# Altium project STM32407VG_DevBoard.PrjPcb
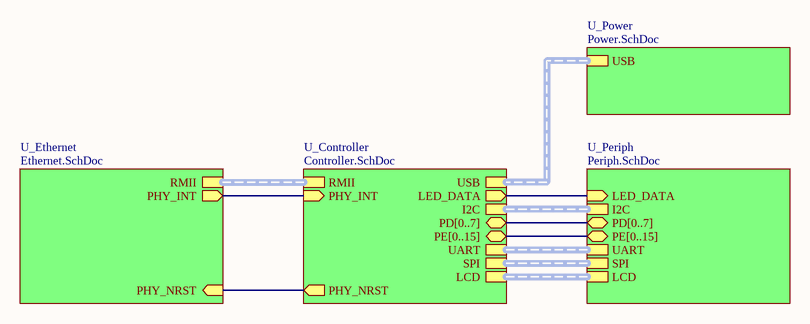
[diagram p0: Main.SchDoc]
5 sheets, 94 parts. Net scope: hierarchical (ports join the sheet entries above them; power ports are global).
Board file: PCB_STM32F407VG.PcbDoc
Sheets:
  Main.SchDoc
    U_Ethernet = Ethernet.SchDoc
    U_Periph = Periph.SchDoc
    U_Controller = Controller.SchDoc
    U_Power = Power.SchDoc

## Sheet Main.SchDoc
size A4; SheetNumber: 1; SheetTotal: 5

### Sub-sheets
U_Controller = Controller.SchDoc: RMII (harness RMII), PHY_INT (in), PHY_NRST (out), USB (harness USB), LED_DATA (out), I2C (harness I2c), PD[0..7] (bidir), PE[0..15] (bidir), UART (harness UART), SPI (harness SPI), LCD (harness LCD)
U_Ethernet = Ethernet.SchDoc: RMII (harness RMII), PHY_INT (out), PHY_NRST (in)
U_Periph = Periph.SchDoc: I2C (harness I2c), LED_DATA (in), PD[0..7] (bidir), PE[0..15] (bidir), UART (harness UART), SPI (harness SPI), LCD (harness LCD)
U_Power = Power.SchDoc: USB (harness USB)

### Nets
LED_DATA: sheet U_Periph/LED_DATA, sheet U_Controller/LED_DATA
PHY_INT: sheet U_Ethernet/PHY_INT, sheet U_Controller/PHY_INT
PHY_NRST: sheet U_Ethernet/PHY_NRST, sheet U_Controller/PHY_NRST

### Buses and harness runs
bus sheet U_Controller/PD[0..7] = sheet U_Periph/PD[0..7]
bus sheet U_Controller/PE[0..15] = sheet U_Periph/PE[0..15]
harness sheet U_Controller/I2C = sheet U_Periph/I2C
harness sheet U_Controller/LCD = sheet U_Periph/LCD
harness sheet U_Controller/RMII = sheet U_Ethernet/RMII
harness sheet U_Controller/SPI = sheet U_Periph/SPI
harness sheet U_Controller/UART = sheet U_Periph/UART
harness sheet U_Controller/USB = sheet U_Power/USB

## Sheet Ethernet.SchDoc
size A4; SheetNumber: 3; SheetTotal: 5
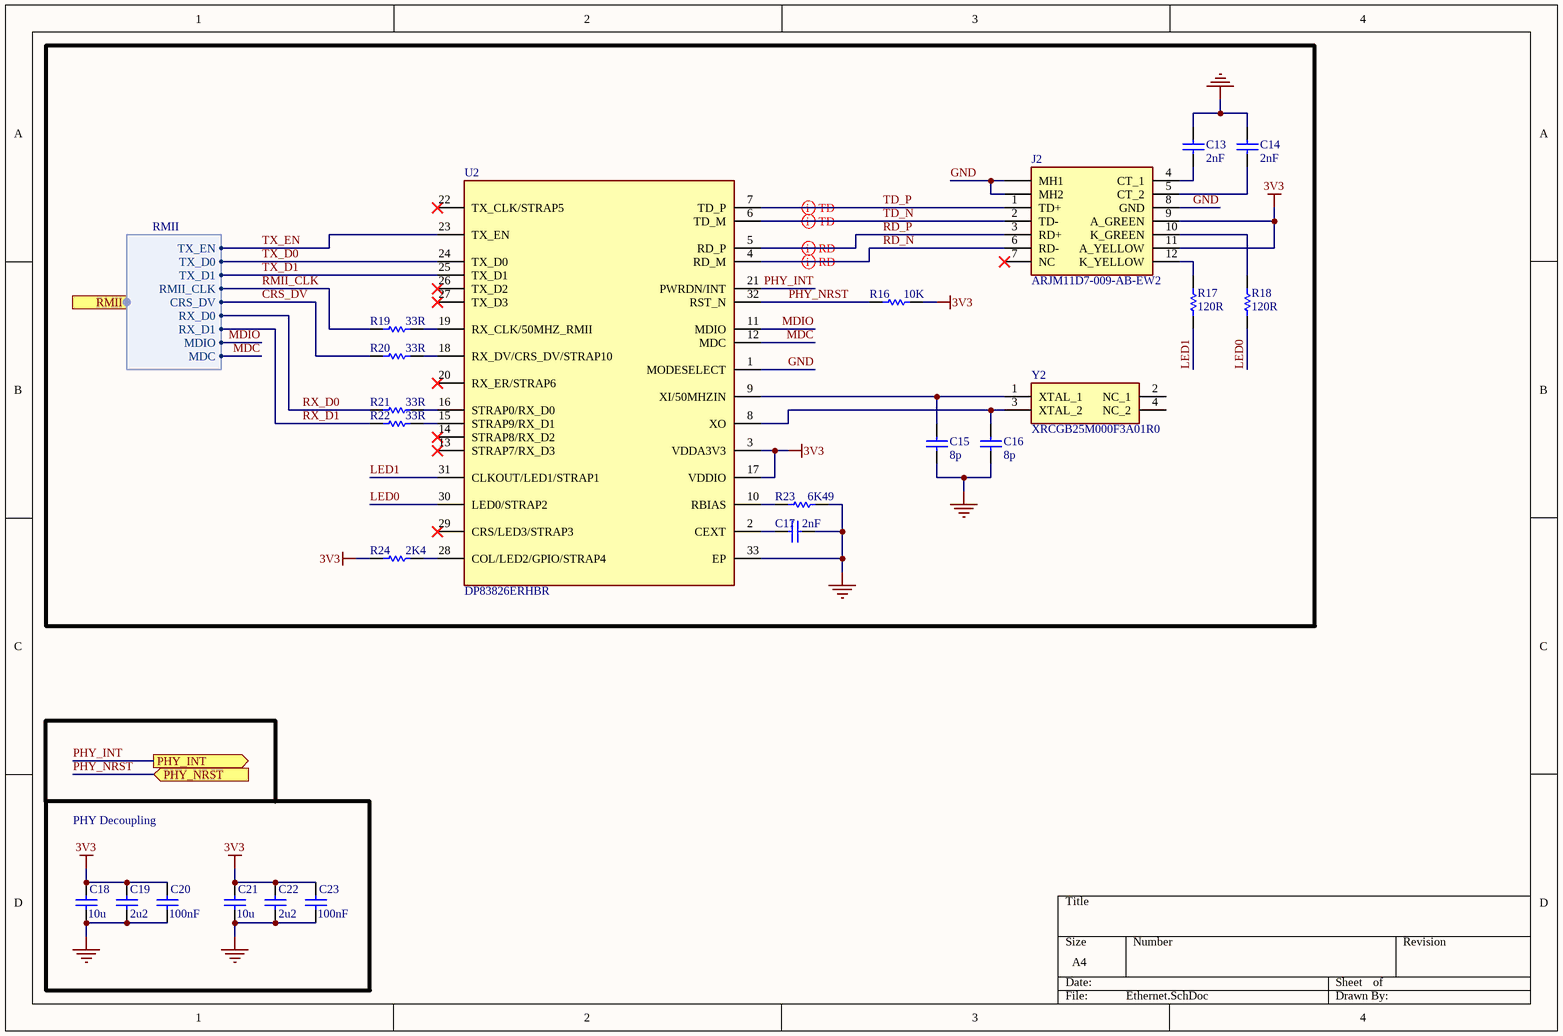
[diagram p1: Ethernet.SchDoc]

### Parts
C13  2nF  [0603]
C14  2nF  [0603]
C15  8p  [0603]
C16  8p  [0603]
C17  2nF  [0603]
C18  10u  [1206]
C19  2u2  [1206]
C20  100nF  [0603]
C21  10u  [1206]
C22  2u2  [1206]
C23  100nF  [0603]
J2  ARJM11D7-009-AB-EW2  [ARJM11D7009ABEW2]
R16  10K  [0603]
R17  120R  [0603]
R18  120R  [0603]
R19  33R  [0603]
R20  33R  [0603]
R21  33R  [0603]
R22  33R  [0603]
R23  6K49  [0603]
R24  2K4  [0603]
U2  DP83826ERHBR  [QFN50P500X500X100-33N-D]
Y2  XRCGB25M000F3A01R0  [XRCGB]

### Blocks framed on the sheet
PHY Decoupling: C18-C23

### Ports
PHY_INT (out, see Main[1A], Controller[1D]), PHY_NRST (in, see Main[1B], Controller[1D]), RMII (harness RMII, see Main[1A], Controller[3D])

### Harnesses
RMII: TX_EN, TX_D0, TX_D1, RMII_CLK, CRS_DV, RX_D0, RX_D1, MDIO, MDC

### Nets
3V3: C18.2 C19.2 C20.2 C21.2 C22.2 C23.2 J2.9(A_GREEN) J2.11(A_YELLOW) R16.2 R24.1 U2.3(VDDA3V3) U2.17(VDDIO)
GND: C13.2 C14.2 C15.1 C16.1 C17.2 C18.1 C19.1 C20.1 C21.1 C22.1 C23.1 J2.8(GND) J2.MH1 J2.MH2 R23.2 U2.1(MODESELECT) U2.33(EP)
CRS_DV: R20.1 ; port RMII.CRS_DV
LED0: R18.1 U2.30(LED0/STRAP2)
LED1: R17.1 U2.31(CLKOUT/LED1/STRAP1)
MDC: U2.12(MDC) ; port RMII.MDC
MDIO: U2.11(MDIO) ; port RMII.MDIO
PHY_INT: U2.21(PWRDN/INT) ; port PHY_INT
PHY_NRST: R16.1 U2.32(RST_N) ; port PHY_NRST
RD_N: J2.6(RD-) U2.4(RD_M)
RD_P: J2.3(RD+) U2.5(RD_P)
RMII_CLK: R19.1 ; port RMII.RMII_CLK
RX_D0: R21.1 ; port RMII.RX_D0
RX_D1: R22.1 ; port RMII.RX_D1
TD_N: J2.2(TD-) U2.6(TD_M)
TD_P: J2.1(TD+) U2.7(TD_P)
TX_D0: U2.24(TX_D0) ; port RMII.TX_D0
TX_D1: U2.25(TX_D1) ; port RMII.TX_D1
TX_EN: U2.23(TX_EN) ; port RMII.TX_EN
NetC13_1: C13.1 J2.4(CT_1)
NetC14_1: C14.1 J2.5(CT_2)
NetC15_2: C15.2 U2.9(XI/50MHZIN) Y2.1(XTAL_1)
NetC16_2: C16.2 U2.8(XO) Y2.3(XTAL_2)
NetC17_1: C17.1 U2.2(CEXT)
NetJ2_10: J2.10(K_GREEN) R18.2
NetJ2_12: J2.12(K_YELLOW) R17.2
NetR19_2: R19.2 U2.19(RX_CLK/50MHZ_RMII)
NetR20_2: R20.2 U2.18(RX_DV/CRS_DV/STRAP10)
NetR21_2: R21.2 U2.16(STRAP0/RX_D0)
NetR22_2: R22.2 U2.15(STRAP9/RX_D1)
NetR23_1: R23.1 U2.10(RBIAS)
NetR24_2: R24.2 U2.28(COL/LED2/GPIO/STRAP4)

Not connected (* = marked no-connect by the designer): J2 7(NC)*; U2 13(STRAP7/RX_D3)* 14(STRAP8/RX_D2)* 20(RX_ER/STRAP6)* 22(TX_CLK/STRAP5)* 26(TX_D2)* 27(TX_D3)* 29(CRS/LED3/STRAP3)*; Y2 2(NC_1) 4(NC_2)

### Layout directives
differential pair: RD_N, RD_P, TD_N, TD_P

### Library data of the parts
C13 C14 C17 = C0603C202J5GACTU: Capacitor 50V / 0603; Value: 2nF
C15 C16 = 06033A8R0DAT2A: Capacitor 25V / 0603; Value: 8p
C18 C21 = C1206C106K3PACTU: Capacitor 50V / 1206; Value: 10u
C19 C22 = C1206C225K5RACAUTO7210: Capacitor 50V / 1206; Value: 2.2u
C20 C23 = C0603C104K1RACAUTO: Capacitor 100V / 0603; Value: 100n
J2 = ARJM11D7-009-AB-EW2: Connector; Manufacturer_Name: ABRACON; Datasheet Link: https://abracon.com/Magnetics/ARJM11.pdf; Height: 14.05mm; Manufacturer_Part_Number: ARJM11D7-009-AB-EW2; Mouser Part Number: 815-RJM11D7009ABEW2; Mouser Price/Stock: https://www.mouser.co.uk/ProductDetail/ABRACON/ARJM11D7-009-AB-EW2?qs=YCa%2FAAYMW01wgGAVSiGYdQ%3D%3D; Arrow Part Number: ARJM11D7-009-AB-EW2; Arrow Price/Stock: https://www.arrow.com/en/products/arjm11d7-009-ab-ew2/abracon?utm_currency=USD&region=europe
R16 = CRCW060310K0FKEA: Resistor 0.1W; Value: 10K
R17 R18 = CRCW0603120RFKEA: Resistor 0.1W; Value: 120R
R19-R22 = CRCW060333R0FKEA: Resistor 0.1W; Value: 33R
R23 = CRCW06036K49FKEA: Resistor 0.1W; Value: 6K49
R24 = CRCW06032K40FKEA: Resistor 0.1W; Value: 2K4
U2 = DP83826ERHBR: Integrated Circuit; Manufacturer_Name: Texas Instruments; Datasheet Link: https://www.ti.com/lit/ds/symlink/dp83826i.pdf?ts=1636699378977&ref_url=https%253A%252F%252Fwww.ti.com%252Fproduct%252FDP83826I; Height: 1mm; Manufacturer_Part_Number: DP83826ERHBR; Mouser Part Number: 595-DP83826ERHBR; Mouser Price/Stock: https://www.mouser.co.uk/ProductDetail/Texas-Instruments/DP83826ERHBR?qs=xZ%2FP%252Ba9zWqY4e7L7xapfgA%3D%3D; Arrow Part Number: DP83826ERHBR; Arrow Price/Stock: https://www.arrow.com/en/products/dp83826erhbr/texas-instruments?region=nac
Y2 = XRCGB25M000F3A01R0: Crystal or Oscillator; Manufacturer_Name: Murata Electronics; Datasheet Link: https://www.murata.com/products/productdata/8803384393758/SPEC-XRCGB25M000F3A01R0.pdf; Height: 0.7mm; Manufacturer_Part_Number: XRCGB25M000F3A01R0; Mouser Part Number: 81-XRCGB25M000F3A01R; Mouser Price/Stock: https://www.mouser.co.uk/ProductDetail/Murata-Electronics/XRCGB25M000F3A01R0?qs=xZ%2FP%252Ba9zWqYh5DvumW%252BlTA%3D%3D; Arrow Part Number: XRCGB25M000F3A01R0; Arrow Price/Stock: https://www.arrow.com/en/products/xrcgb25m000f3a01r0/murata-manufacturing?region=nac

## Sheet Periph.SchDoc
size A4; SheetNumber: 5; SheetTotal: 5
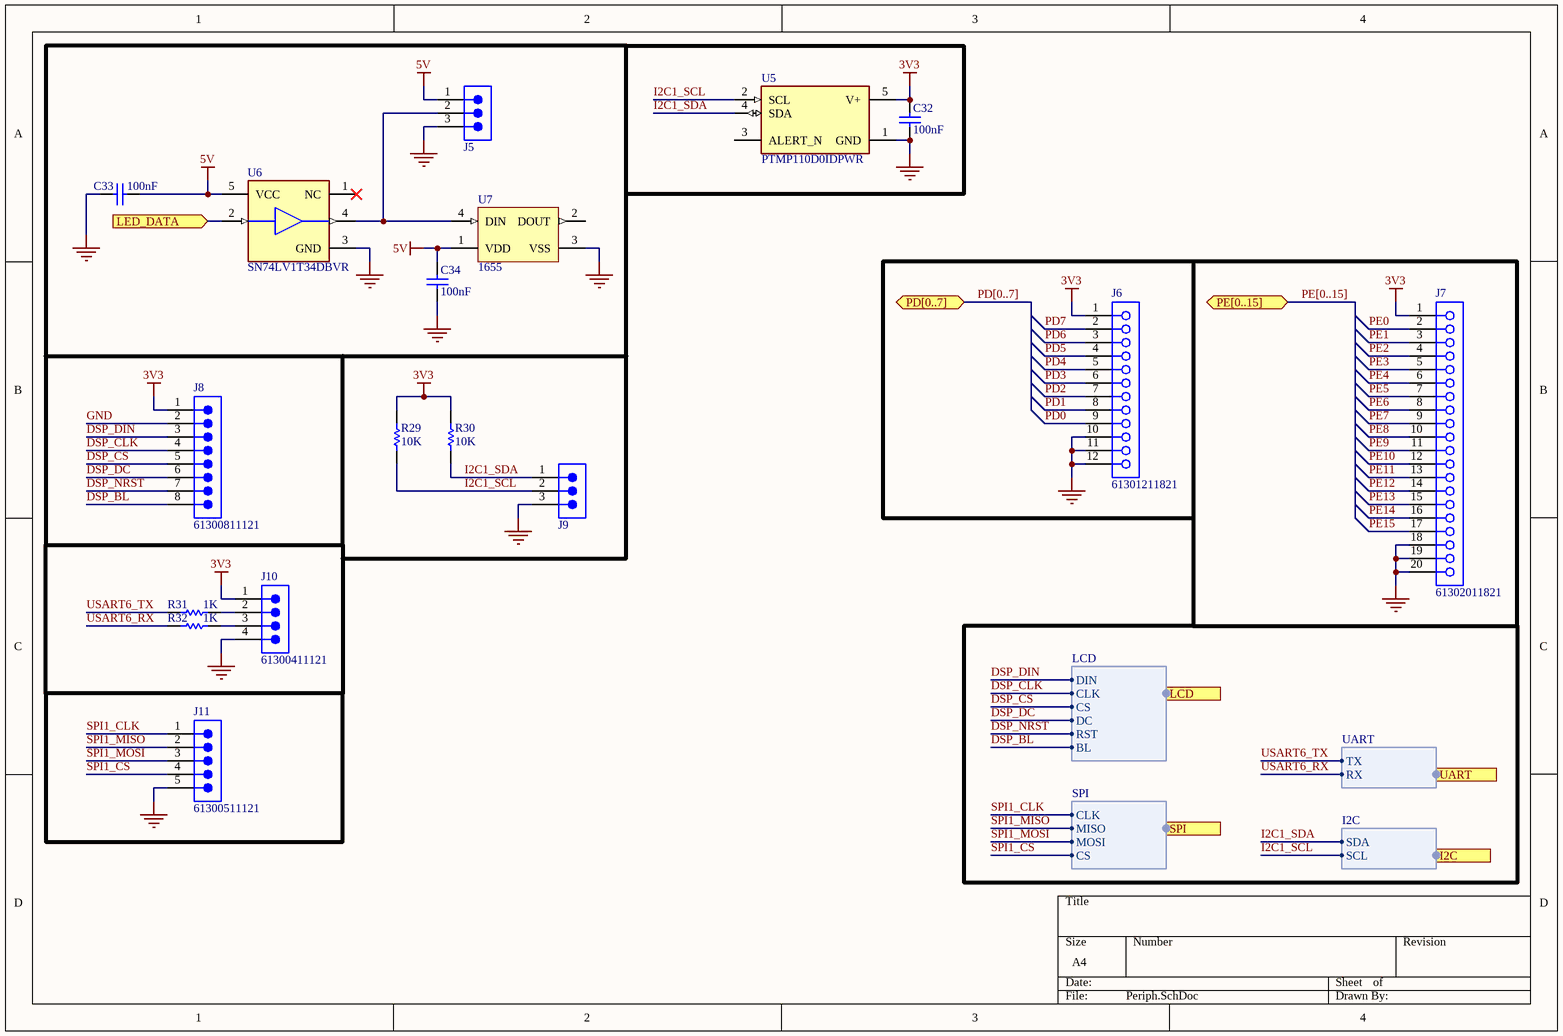
[diagram p2: Periph.SchDoc]

### Parts
C32  100nF  [0603]
C33  100nF  [0603]
C34  100nF  [0603]
J5  61300311121  [61300311121]  (value not drawn)
J6  61301211821  [61301211821]
J7  61302011821  [61302011821]
J8  61300811121  [61300811121]
J9  61300311121  [61300311121]  (value not drawn)
J10  61300411121  [61300411121]
J11  61300511121  [61300511121]
R29  10K  [0603]
R30  10K  [0603]
R31  1K  [0603]
R32  1K  [0603]
U5  PTMP110D0IDPWR  [DPW0005A-MFG]
U6  SN74LV1T34DBVR  [FP-DBV0005A-IPC_B]
U7  1655  [ADA-RGB-1655_V]

### Ports
I2C (harness I2c, see Main[2B], Controller[4C]), LCD (harness LCD, see Main[2B], Controller[3C]), LED_DATA (in, see Main[2A], Controller[1D]), PD[0..7] (bidir, see Main[2B], Controller[2B]), PE[0..15] (bidir, see Main[2B], Controller[1D]), SPI (harness SPI, see Main[2B], Controller[4C]), UART (harness UART, see Main[2B], Controller[4C])

### Harnesses
I2C: SDA, SCL
UART: TX, RX
SPI: CLK, MISO, MOSI, CS
LCD: DIN, CLK, CS, DC, RST, BL

### Nets
3V3: C32.1 J6.1 J7.1 J8.1 J10.1 R29.2 R30.2 U5.5(V+)
5V: C33.2 C34.1 J5.1 U6.5(VCC) U7.1(VDD)
GND: C32.2 C33.1 C34.2 J5.3 J6.10 J6.11 J6.12 J7.18 J7.19 J7.20 J8.2 J9.3 J10.4 J11.5 U5.1(GND) U6.3(GND) U7.3(VSS)
DSP_BL: J8.8 ; port LCD.BL
DSP_CLK: J8.4 ; port LCD.CLK
DSP_CS: J8.5 ; port LCD.CS
DSP_DC: J8.6 ; port LCD.DC
DSP_DIN: J8.3 ; port LCD.DIN
DSP_NRST: J8.7 ; port LCD.RST
I2C1_SCL: J9.2 R29.1 U5.2(SCL) ; port I2C.SCL
I2C1_SDA: J9.1 R30.1 U5.4(SDA) ; port I2C.SDA
LED_DATA: U6.2(A) ; port LED_DATA
PD0: J6.9
PD1: J6.8
PD2: J6.7
PD3: J6.6
PD4: J6.5
PD5: J6.4
PD6: J6.3
PD7: J6.2
PE0: J7.2
PE1: J7.3
PE2: J7.4
PE3: J7.5
PE4: J7.6
PE5: J7.7
PE6: J7.8
PE7: J7.9
PE8: J7.10
PE9: J7.11
PE10: J7.12
PE11: J7.13
PE12: J7.14
PE13: J7.15
PE14: J7.16
PE15: J7.17
SPI1_CLK: J11.1 ; port SPI.CLK
SPI1_CS: J11.4 ; port SPI.CS
SPI1_MISO: J11.2 ; port SPI.MISO
SPI1_MOSI: J11.3 ; port SPI.MOSI
USART6_RX: R32.1 ; port UART.RX
USART6_TX: R31.1 ; port UART.TX
NetJ5_2: J5.2 U6.4(Y) U7.4(DIN)
NetJ10_2: J10.2 R31.2
NetJ10_3: J10.3 R32.2

Not connected (* = marked no-connect by the designer): U5 3(ALERT_N); U6 1(NC)*; U7 2(DOUT)

### Buses and harness runs
bus PD[0..7] = port PD[0..7]
bus PE[0..15] = port PE[0..15]

### Library data of the parts
C32-C34 = C0603C104K1RACAUTO: Capacitor 100V / 0603; Value: 100n
J5 J9 = CMP-1502-01062-3: NexarPartId: 32855521; Current Rating: 3A; Voltage Rating: 250V; Number of Positions: 3; Pitch: 2.54mm; Contact Resistance: 20mΩ; Connector Type: Male Pin; Gender: Male; REACH SVHC: Unknown; Packaging: Bulk; Contact Material: Copper; Min Operating Temperature: -40°C; Number of Rows: 1; Orientation: Vertical; RoHS: Compliant; Contact Plating: Gold; Max Operating Temperature: 105°C; Mount: Through Hole; Height: 8.94mm; Operating Supply Voltage: 250V; Number of Pins: 3; Contact Mating Length: 5.9944mm; Number of Contacts: 3; Color: Black; Lead Free: Lead Free; Lead Pitch: 2.54mm; Termination: Solder
J6 = CMP-1502-01337-3: NexarPartId: 24514107; Operating Supply Voltage: 250V; Gender: Female; Current Rating: 3A; Contact Resistance: 20mΩ; Orientation: Vertical; Number of Pins: 12; RoHS: Non-Compliant; Lead Pitch: 2.54mm
J7 = CMP-1502-01348-3: NexarPartId: 61924744; Gender: Female; Current Rating: 3A; Operating Supply Voltage: 250V; Contact Resistance: 20mΩ; RoHS: Non-Compliant; Number of Pins: 20; Orientation: Vertical; Lead Pitch: 2.54mm
J8 = CMP-1502-01076-3: NexarPartId: 32855533; Connector Type: Male Pin; Number of Contacts: 8; Voltage Rating: 250V; Current Rating: 3A; Contact Resistance: 20mΩ; Pitch: 2.54mm; Gender: Male; Termination: Solder; Contact Material: Copper; Mount: Through Hole; Lead Pitch: 2.54mm; Number of Positions: 8; Operating Supply Voltage: 250V; Number of Pins: 8; Max Operating Temperature: 105°C; Height: 8.54mm; REACH SVHC: Unknown; Number of Rows: 1; Packaging: Bulk; Contact Plating: Gold; Contact Mating Length: 5.9944mm; Orientation: Vertical; RoHS: Compliant; Color: Black; Min Operating Temperature: -40°C
J10 = CMP-1502-01064-3: NexarPartId: 32855522; Operating Supply Voltage: 250V; Pitch: 2.54mm; Contact Resistance: 20mΩ; Number of Positions: 4; Current Rating: 3A; Connector Type: Male Pin; Gender: Male; Contact Plating: Gold; Height: 8.89mm; Lead Pitch: 2.54mm; Lead Free: Lead Free; Contact Mating Length: 5.9944mm; Number of Rows: 1; Termination: Solder; Packaging: Bulk; REACH SVHC: Unknown; Min Operating Temperature: -40°C; RoHS: Compliant; Number of Contacts: 4; Voltage Rating: 250V; Color: Black; Max Operating Temperature: 105°C; Contact Material: Copper; Mount: Through Hole; Orientation: Vertical; Number of Pins: 4
J11 = CMP-1502-01068-3: NexarPartId: 32855526; Connector Type: Male Pin; Gender: Male; Contact Resistance: 20mΩ; Pitch: 2.54mm; Operating Supply Voltage: 250V; Current Rating: 3A; Number of Contacts: 5; Lead Free: Lead Free; Color: Black; Packaging: Bulk; Lead Pitch: 2.54mm; Contact Material: Copper; Min Operating Temperature: -40°C; Contact Mating Length: 5.9944mm; Voltage Rating: 250V; Number of Pins: 5; Number of Positions: 5; Height: 8.89mm; Orientation: Vertical; REACH SVHC: Unknown; RoHS: Compliant; Contact Plating: Gold; Max Operating Temperature: 105°C; Mount: Through Hole; Number of Rows: 1; Termination: Solder
R29 R30 = CRCW060310K0FKEA: Resistor 0.1W; Value: 10K
R31 R32 = CRCW06031K00FKEA: Resistor 0.1W; Value: 1K
U5 = PTMP110D0IDPWR: No Description Available; Mfr_Name: Texas Instruments; TYPE: TYPE; RefDes: RefDes
U6 = CMP-0859-00123-4: IC BUF NON-INVERT 5.5V SOT23-5; Low Level Output Current: 8mA; Polarity: Non-Inverting; Number of Channels: 1; Propagation Delay: 15.5ns; High Level Output Current: -8mA; Quiescent Current: 1uA; Logic Function: Buffer; Min Supply Voltage: 1.6V; Min Operating Temperature: -40°C; Package Quantity: 3000; Max Operating Temperature: 125°C; Operating Supply Current: 8mA; Radiation Hardening: No; REACH SVHC: No SVHC; Number of Bits per Element: 1; Mount: Surface Mount; Number of Outputs: 1; Lead Free: Lead Free; Number of Pins: 5; Weight: 0.000353oz; Number of Output Lines: 1; Number of Elements: 1; Number of Input Lines: 1; Number of Bits: 1; Case/Package: SOT-23-5; Packaging: Tape and Reel; Max Supply Voltage: 5.5V; Number of Inputs: 1
U7 = CMP-2000-05026-1: Intelligent Control LED Integrated Light Source, 3.5 to 5.3 V, -25 to 80 degC, 4-Pin SMD, RoHS, Tape and Reel; Manufacturer: Adafruit-Industries-LLC; Number of LEDs: 10; Configuration: Discrete; Utilized LED: WS2812(5050); Datasheet URL: http://datasheet.octopart.com/ADA1655-Adafruit-Industries-datasheet-32028139.pdf; Series: Neopixel; Interface: -; Package Description: 4-Pin Surface Mount Device, Body 5 x 5 mm; Color: Red,Green,Blue(RGB); Category: Optoelectronics; Controller Type: -; Package Reference: 1655; Manufacturer URL: https://www.adafruit.com/; Mounting Type: SurfaceMount; Datasheet Version: May-13; Size / Dimension: 5.00mmLx5.00mmW; Family: Addressable,Specialty

## Sheet Controller.SchDoc
size A4; SheetNumber: 2; SheetTotal: 5
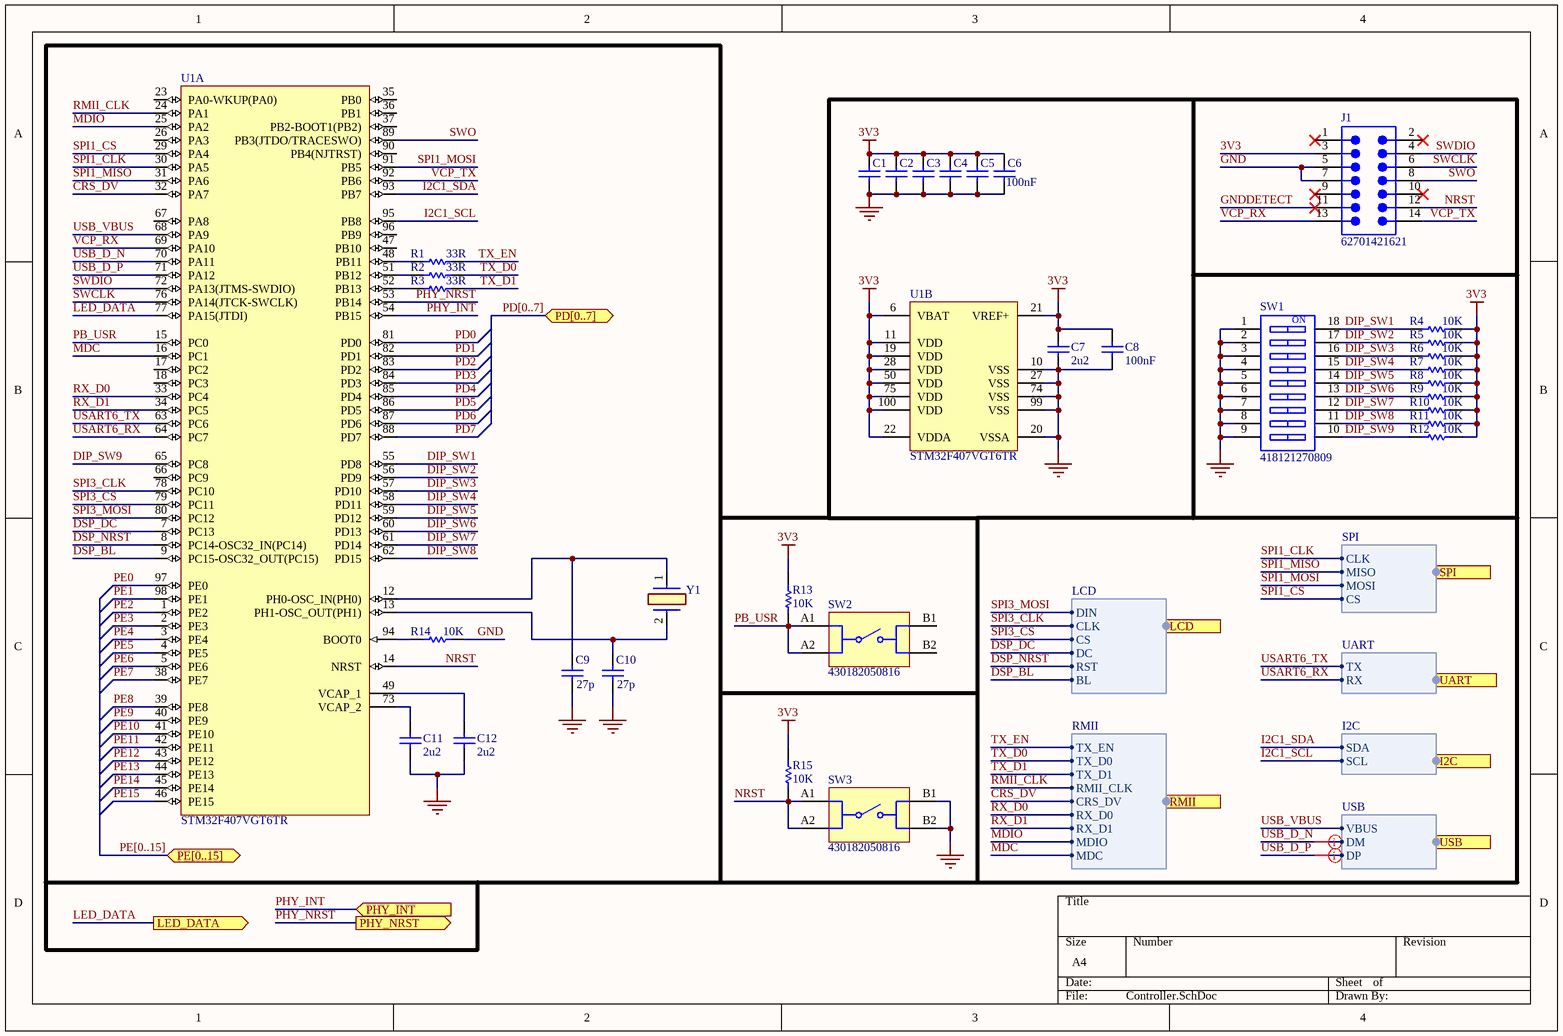
[diagram p3: Controller.SchDoc]

### Parts
C1  100nF  [0603]  (value not drawn)
C2  100nF  [0603]  (value not drawn)
C3  100nF  [0603]  (value not drawn)
C4  100nF  [0603]  (value not drawn)
C5  100nF  [0603]  (value not drawn)
C6  100nF  [0603]
C7  2u2  [1206]
C8  100nF  [0603]
C9  27p  [0603]
C10  27p  [0603]
C11  2u2  [1206]
C12  2u2  [1206]
J1  62701421621  [62701421621]
R1  33R  [0603]
R2  33R  [0603]
R3  33R  [0603]
R4  10K  [0603]
R5  10K  [0603]
R6  10K  [0603]
R7  10K  [0603]
R8  10K  [0603]
R9  10K  [0603]
R10  10K  [0603]
R11  10K  [0603]
R12  10K  [0603]
R13  10K  [0603]
R14  10K  [0603]
R15  10K  [0603]
SW1  418121270809  [418121270809]
SW2  430182050816  [430182050816]
SW3  430182050816  [430182050816]
U1  STM32F407VGT6TR  [STM-LQFP100_V]  (parts A,B of 2)
Y1  ABLS7M-16.000MHZ-B-2-T  [ABLS7]  (value not drawn)

### Ports
I2C (harness I2c, see Main[2B], Periph[4D]), LCD (harness LCD, see Main[2B], Periph[3C]), LED_DATA (out, see Main[2A], Periph[1A]), PD[0..7] (bidir, see Main[2B], Periph[3B]), PE[0..15] (bidir, see Main[2B], Periph[4B]), PHY_INT (in, see Main[2A], Ethernet[1C]), PHY_NRST (out, see Main[2B], Ethernet[1D]), RMII (harness RMII, see Main[2A], Ethernet[1B]), SPI (harness SPI, see Main[2B], Periph[3D]), UART (harness UART, see Main[2B], Periph[4D]), USB (harness USB, see Main[2A], Power[4D])

### Harnesses
RMII: TX_EN, TX_D0, TX_D1, RMII_CLK, CRS_DV, RX_D0, RX_D1, MDIO, MDC
USB: VBUS, DM, DP
I2C: SDA, SCL
UART: TX, RX
SPI: CLK, MISO, MOSI, CS
LCD: DIN, CLK, CS, DC, RST, BL

### Nets
3V3: C1.2 C2.2 C3.2 C4.2 C5.2 C6.2 C7.2 C8.2 J1.3 R4.2 R5.2 R6.2 R7.2 R8.2 R9.2 R10.2 R11.2 R12.2 R13.2 R15.2 U1.6(VBAT) U1.11(VDD) U1.19(VDD) U1.21(VREF+) U1.22(VDDA) U1.28(VDD) U1.50(VDD) U1.75(VDD) U1.100(VDD)
GND: C1.1 C2.1 C3.1 C4.1 C5.1 C6.1 C7.1 C8.1 C9.1 C10.1 C11.1 C12.1 J1.5 J1.7 R14.2 SW1.1 SW1.2 SW1.3 SW1.4 SW1.5 SW1.6 SW1.7 SW1.8 SW1.9 SW3.B1 SW3.B2 U1.10(VSS) U1.20(VSSA) U1.27(VSS) U1.74(VSS) U1.99(VSS)
CRS_DV: U1.32(PA7) ; port RMII.CRS_DV
DIP_SW1: R4.1 SW1.18 U1.55(PD8)
DIP_SW2: R5.1 SW1.17 U1.56(PD9)
DIP_SW3: R6.1 SW1.16 U1.57(PD10)
DIP_SW4: R7.1 SW1.15 U1.58(PD11)
DIP_SW5: R8.1 SW1.14 U1.59(PD12)
DIP_SW6: R9.1 SW1.13 U1.60(PD13)
DIP_SW7: R10.1 SW1.12 U1.61(PD14)
DIP_SW8: R11.1 SW1.11 U1.62(PD15)
DIP_SW9: R12.1 SW1.10 U1.65(PC8)
DSP_BL: U1.9(PC15-OSC32_OUT(PC15)) ; port LCD.BL
DSP_DC: U1.7(PC13) ; port LCD.DC
DSP_NRST: U1.8(PC14-OSC32_IN(PC14)) ; port LCD.RST
GNDDETECT: J1.11
I2C1_SCL: U1.95(PB8) ; port I2C.SCL
I2C1_SDA: U1.93(PB7) ; port I2C.SDA
LED_DATA: U1.77(PA15(JTDI)) ; port LED_DATA
MDC: U1.16(PC1) ; port RMII.MDC
MDIO: U1.25(PA2) ; port RMII.MDIO
NRST: J1.12 R15.1 SW3.A1 SW3.A2 U1.14(NRST)
PB_USR: R13.1 SW2.A1 SW2.A2 U1.15(PC0)
PD0: U1.81(PD0)
PD1: U1.82(PD1)
PD2: U1.83(PD2)
PD3: U1.84(PD3)
PD4: U1.85(PD4)
PD5: U1.86(PD5)
PD6: U1.87(PD6)
PD7: U1.88(PD7)
PE0: U1.97(PE0)
PE1: U1.98(PE1)
PE2: U1.1(PE2)
PE3: U1.2(PE3)
PE4: U1.3(PE4)
PE5: U1.4(PE5)
PE6: U1.5(PE6)
PE7: U1.38(PE7)
PE8: U1.39(PE8)
PE9: U1.40(PE9)
PE10: U1.41(PE10)
PE11: U1.42(PE11)
PE12: U1.43(PE12)
PE13: U1.44(PE13)
PE14: U1.45(PE14)
PE15: U1.46(PE15)
PHY_INT: U1.54(PB15) ; port PHY_INT
PHY_NRST: U1.53(PB14) ; port PHY_NRST
RMII_CLK: U1.24(PA1) ; port RMII.RMII_CLK
RX_D0: U1.33(PC4) ; port RMII.RX_D0
RX_D1: U1.34(PC5) ; port RMII.RX_D1
SPI1_CLK: U1.30(PA5) ; port SPI.CLK
SPI1_CS: U1.29(PA4) ; port SPI.CS
SPI1_MISO: U1.31(PA6) ; port SPI.MISO
SPI1_MOSI: U1.91(PB5) ; port SPI.MOSI
SPI3_CLK: U1.78(PC10) ; port LCD.CLK  [project net DSP_CLK]
SPI3_CS: U1.79(PC11) ; port LCD.CS  [project net DSP_CS]
SPI3_MOSI: U1.80(PC12) ; port LCD.DIN  [project net DSP_DIN]
SWCLK: J1.6 U1.76(PA14(JTCK-SWCLK))
SWDIO: J1.4 U1.72(PA13(JTMS-SWDIO))
SWO: J1.8 U1.89(PB3(JTDO/TRACESWO))
TX_D0: R2.2 ; port RMII.TX_D0
TX_D1: R3.2 ; port RMII.TX_D1
TX_EN: R1.2 ; port RMII.TX_EN
USART6_RX: U1.64(PC7) ; port UART.RX
USART6_TX: U1.63(PC6) ; port UART.TX
USB_D_N: U1.70(PA11) ; port USB.DM
USB_D_P: U1.71(PA12) ; port USB.DP
USB_VBUS: U1.68(PA9) ; port USB.VBUS
VCP_RX: J1.13 U1.69(PA10)
VCP_TX: J1.14 U1.92(PB6)
NetC9_2: C9.2 U1.12(PH0-OSC_IN(PH0)) Y1.1
NetC10_2: C10.2 U1.13(PH1-OSC_OUT(PH1)) Y1.2
NetC11_2: C11.2 U1.73(VCAP_2)
NetC12_2: C12.2 U1.49(VCAP_1)
NetR1_1: R1.1 U1.48(PB11)
NetR2_1: R2.1 U1.51(PB12)
NetR3_1: R3.1 U1.52(PB13)
NetR14_1: R14.1 U1.94(BOOT0)

Not connected (* = marked no-connect by the designer): J1 1* 2* 9* 10*; SW2 B1 B2; U1 17(PC2) 18(PC3) 23(PA0-WKUP(PA0)) 26(PA3) 35(PB0) 36(PB1) 37(PB2-BOOT1(PB2)) 47(PB10) 66(PC9) 67(PA8) 90(PB4(NJTRST)) 96(PB9)

### Buses and harness runs
bus PD[0..7] = port PD[0..7]
bus PE[0..15] = port PE[0..15]

### Layout directives
differential pair: USB_D_N, USB_D_P

### Notes on the sheet
- (in symbol CMP-1438-00009-2) ON

### Library data of the parts
C1-C6 C8 = C0603C104K1RACAUTO: Capacitor 100V / 0603; Value: 100n
C7 C11 C12 = C1206C225K5RACAUTO7210: Capacitor 50V / 1206; Value: 2.2u
C9 C10 = C0603C270K1HACTU: Capacitor 100V / 0603; Value: 27p
J1 = CMP-03913-122639944-1: 62701421621 Conn, Header, 14Pos, 2Row, 1.27Mm Rohs Compliant: Yes; Insulation Resistance: 1GΩ; Current Rating: 1A; NexarPartId: 122639944; Min Operating Temperature: -40°C; Length: 13.64mm; RoHS: Compliant; Max Operating Temperature: 105°C; Number of Pins: 14; Pitch: 1.27mm
R1-R3 = CRCW060333R0FKEA: Resistor 0.1W; Value: 33R
R4-R15 = CRCW060310K0FKEA: Resistor 0.1W; Value: 10K
SW1 = CMP-1438-00009-2: NexarPartId: 109675040; Current Rating: 25mA; Voltage Rating: 24V; Insulation Resistance: 100MΩ; Max Operating Temperature: 85°C; Packaging: Tape and Reel; Length: 23.8mm; Contact Plating: Gold; Min Operating Temperature: -40°C; RoHS: Compliant
SW2 SW3 = CMP-1452-00014-8: Switch Tactile N.O. SPST Round Button Gull Wing 0.05A 12VDC 1000000Cycles 1.57N SMD Reel; Actuator Material: Liquid Crystal Polymer, Polymer; Switch Function: Off-Mom; Life (Cycles): 1Mcycles; Current Rating: 50mA; Switch Travel: 250µm; Voltage Rating: 12V; Insulation Resistance: 100MΩ; Actuator Length: 1.6mm; Illumination Type: Illuminated, Non-Illuminated; Length: 6.2mm; Height: 5mm; Max Operating Temperature: 85°C; Contact Material: Stainless Steel, Steel; Mount: Surface Mount; Throw Configuration: SPST; Contact Plating: Silver; Lead Free: Lead Free; Width: 6.2mm; Mechanical Life: 1Mcycles; Color: Black; Voltage Rating (DC): 12V; Contact Resistance: 100mΩ; REACH SVHC: No SVHC; Min Operating Temperature: -40°C; Contact Current Rating: 50mA; Termination: Gull Wing; RoHS: Compliant; Packaging: Tape and Reel; Diameter: 3.5mm
U1 = CMP-0243-00033-2: ARM Cortex-M4 32-bit MCU+FPU, 210 DMIPS, 1024 kB Flash, 192 kB Internal RAM, 82 I/Os, 100-pin LQFP, -40 to 85 degC, Tape and Reel; Manufacturer: STMicroelectronics; Supply Voltage(Vcc) max (V): 3.6; Supply Voltage(Vcc) min (V): 1.8; D/A Converter: 2x12-bit; I/Os (High Current): 82; Operating Frequency(F) (Processor speed) (MHz): 168; FLASH Size (Prog) (kB): 1024; Internal RAM Size (kB): 192; ComponentLink1Description: Manufacturer URL; PackageDescription: 100-Pin Low Profile Quad Flat Package, 14 x 14 mm Body, 0.5 mm Pitch; DatasheetVersion: Rev. 4; ComponentLink1URL: http://www.st.com/web/en/home.html; Mounting Technology: Surface Mount; ComponentLink3URL: http://www.st.com/st-web-ui/static/active/en/resource/technical/document/data_brief/DM00071938.pdf; PartNumber: STM32F407VGT6TR; ComponentLink2URL: http://www.st.com/st-web-ui/static/active/en/resource/technical/document/datasheet/DM00037051.pdf; Packing: Tape and Reel; ComponentLink2Description: Datasheet; PackageReference: LQFP100; ComponentLink3Description: Package Specification; PackageVersion: Rev. 1, 06/2013; Core: ARM Cortex-M4
Y1 = ABLS7M-16.000MHZ-B-2-T: Crystal or Oscillator; Manufacturer_Name: ABRACON; Datasheet Link: https://abracon.com/Resonators/ABLS7M.pdf; Height: 2.3mm; Manufacturer_Part_Number: ABLS7M-16.000MHZ-B-2-T; Mouser Part Number: 815-ABLS7M-16-B-2-T; Mouser Price/Stock: https://www.mouser.co.uk/ProductDetail/ABRACON/ABLS7M-16.000MHZ-B-2-T?qs=%252Bk6%2F5FB6qrn1VjId6JGmFw%3D%3D; Arrow Part Number: ABLS7M-16.000MHZ-B-2-T; Arrow Price/Stock: https://www.arrow.com/en/products/abls7m-16.000mhz-b-2-t/abracon?region=nac

## Sheet Power.SchDoc
size A4; SheetNumber: 4; SheetTotal: 5
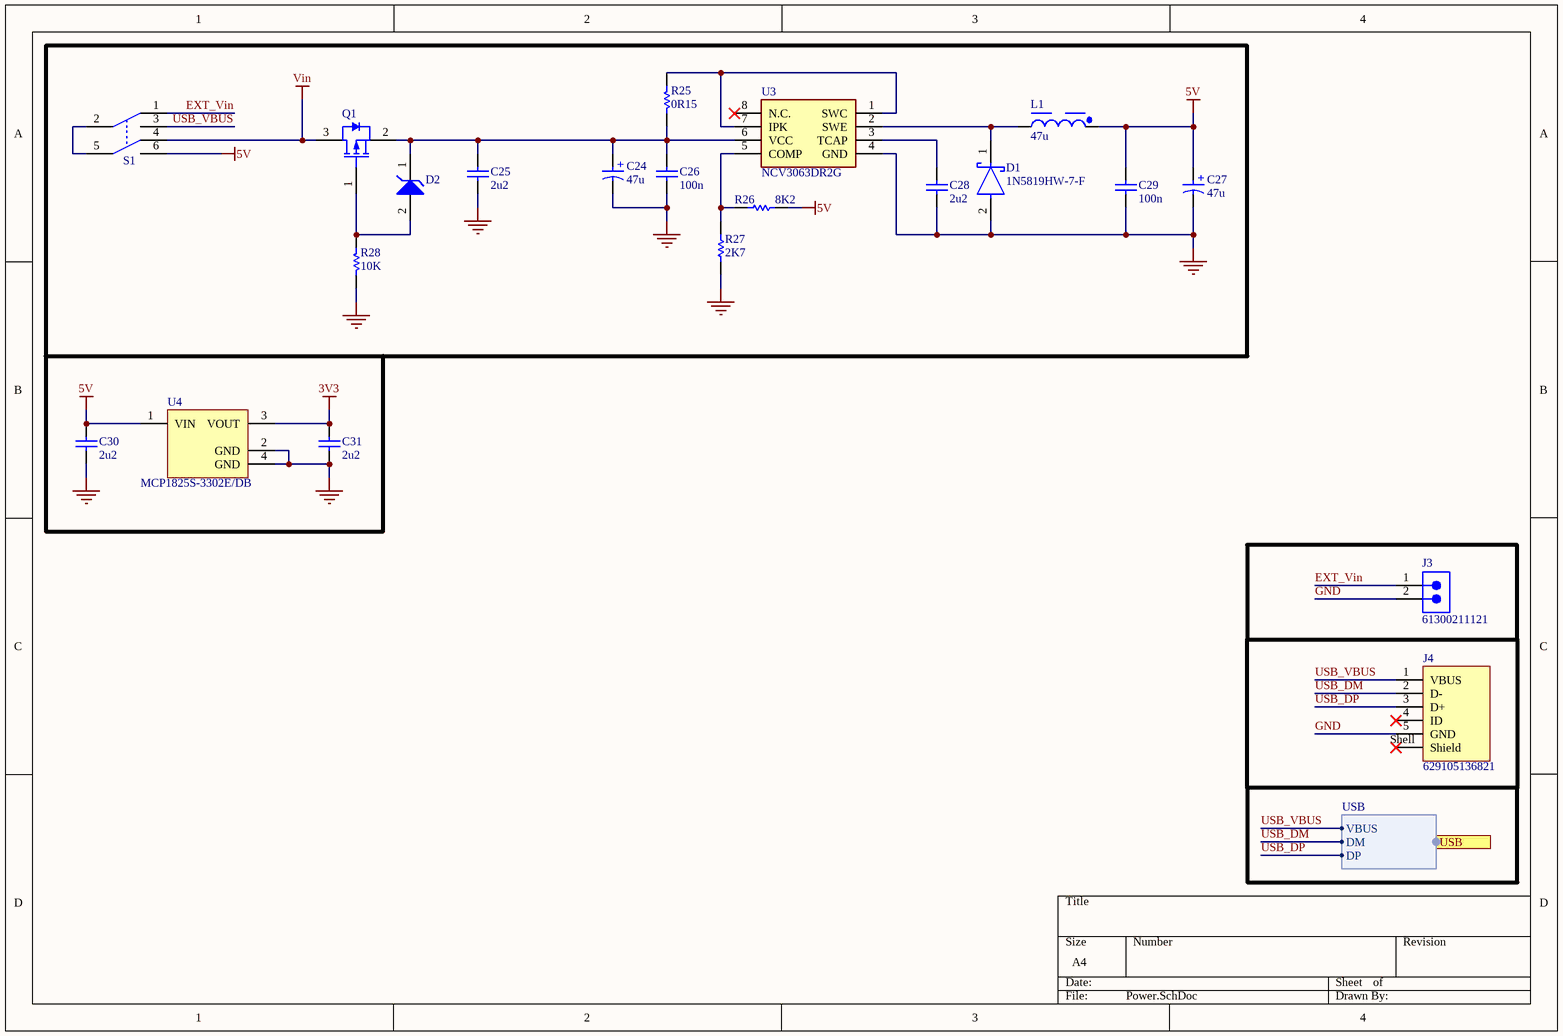
[diagram p4: Power.SchDoc]

### Parts
C24  47u  [WCAP-ASLI_D6.3H7.7]
C25  2u2  [1206]
C26  100n  [0603]
C27  47u  [WCAP-ASLI_D6.3H7.7]
C28  2u2  [1206]
C29  100n  [0603]
C30  2u2  [1206]
C31  2u2  [1206]
D1  1N5819HW-7-F  [FP-SOD123-IPC_A]
D2  SZMMSZ4687T1G  [ONSC-SOD-123-2-425-04_V]  (value not drawn)
J3  61300211121  [61300211121]
J4  629105136821  [629105136821]
L1  47u  [WE-HEPC_6030]
Q1  NTRV4101PT1G  [ONSC-SOT-23-3-318-08_V]  (value not drawn)
R25  0R15  [1206]
R26  8K2  [0603]
R27  2K7  [0603]
R28  10K  [0603]
S1  OS202013MT8QN1  [OS202013MT8QN1]  (value not drawn)
U3  NCV3063DR2G  [SOIC127P600X175-8N]
U4  MCP1825S-3302E/DB  [SOT-223-DB3_N]

### Ports
USB (harness USB, see Main[2A], Controller[4D])

### Harnesses
USB: VBUS, DM, DP

### Nets
3V3: C31.2 U4.3(VOUT)
5V: C27.1(P) C29.2 C30.2 L1.1 R26.2 S1.6(NO_2) U4.1(VIN)
GND: C24.2(N) C25.1 C26.1 C27.2(N) C28.1 C29.1 C30.1 C31.1 D1.2(A) J3.2 J4.5(GND) R27.1 R28.1 U3.4(GND) U4.2(GND) U4.4(GND)
Vin: Q1.3(D) S1.4(NC_2)
EXT_Vin: J3.1 S1.1(NC_1)
USB_DM: J4.2(D-) ; port USB.DM  [project net USB_D_N]
USB_DP: J4.3(D+) ; port USB.DP  [project net USB_D_P]
USB_VBUS: J4.1(VBUS) S1.3(NO_1) ; port USB.VBUS
NetC24_1: C24.1(P) C25.2 C26.2 D2.1(K) Q1.2(S) R25.1 U3.6(VCC)
NetC28_2: C28.2 U3.3(TCAP)
NetD1_1: D1.1(C) L1.2 U3.2(SWE)
NetD2_2: D2.2(A) Q1.1(G) R28.2
NetR25_2: R25.2 U3.1(SWC) U3.7(IPK)
NetR26_1: R26.1 R27.2 U3.5(COMP)
NetS1_2: S1.2(COM_1) S1.5(COM_2)

Not connected (* = marked no-connect by the designer): J4 4(ID)* Shell(Shield)*; U3 8(N.C.)*

### Notes on the sheet
- (in symbol CMP-03913-53914620-1) +

### Library data of the parts
C24 C27 = CMP-03913-53914620-1: 865080645012 WCAP-ASLI Aluminum Electrolytic Capacitors; Life (Hours): 2000hours; Voltage Rating: 50V; Impedance: 700mΩ; Capacitance: 47µF; Insulation Resistance: 2.12766MΩ; Leakage Current: 23.5µA; ESR (Equivalent Series Resistance): 540.449mΩ; Ripple Current (AC): 230mA; Case/Package: Radial; Length: 7.7mm; Diameter: 6.3mm; Max Operating Temperature: 105°C; REACH SVHC: Unknown; RoHS: Compliant; Voltage Rating (DC): 50V; Packaging: Cut Tape; Min Operating Temperature: -55°C; Width: 6.6mm; Height: 7.7mm; NexarPartId: 53914620; Ripple Current: 230mA
C25 C28 C30 C31 = C1206C225K5RACAUTO7210: Capacitor 50V / 1206; Value: 2.2u
C26 C29 = GA0603Y104KXAAC31G: Capacitor 50V / 0603; Value: 100n
D1 = CMP-0303-00003-3: DIODE SCHOTTKY 40V 1A SOD123; Forward Voltage: 450mV; Capacitance: 110pF; Max Forward Surge Current (Ifsm): 25A; Peak Reverse Current: 50uA; Polarity: Standard; Element Configuration: Single; Max Power Dissipation: 450mW; Min Operating Temperature: -65°C; Package Quantity: 3000; Contact Plating: Tin; Weight: 0.000353oz; Max Repetitive Reverse Voltage (Vrrm): 40V; Max Reverse Voltage (DC): 40V; Height: 1.25mm; Average Rectified Current: 1A; Width: 1.7mm; Case/Package: SOD-123-2; Lead Free: Lead Free; Max Operating Temperature: 125°C; Current Rating: 1A; Termination: SMD/SMT; Forward Current: 1A; Radiation Hardening: No; Number of Pins: 2; Length: 2.85mm; Voltage Rating (DC): 40V; REACH SVHC: No SVHC; Peak Non-Repetitive Surge Current: 25A; Packaging: Tape and Reel; Output Current: 1A
D2 = CMP-1060-00576-1: Zener Voltage Regulator, 500 mW, 2-Pin SOD-123, Pb-Free, Tape and Reel; Manufacturer: On Semiconductor; P Max (W): 0.5; VZ Typ (V): 4.3; Packing: Tape and Reel; PackageVersion: Rev. G, 10/2009; PackageDescription: 2-Pin SOD, Body 1.6 x 2.69 mm; PartNumber: SZMMSZ4687T1G; ComponentLink3URL: http://www.onsemi.com/pub_link/Collateral/425-04.PDF; Mounting Technology: Surface Mount; ComponentLink3Description: Package Specification; ComponentLink1Description: Manufacturer URL; RoHS: Pb-Free; PackageReference: SOD-123-2-425-04; ComponentLink1URL: http://www.onsemi.com/; ComponentLink2Description: Datasheet; DatasheetVersion: Rev. 9; ComponentLink2URL: http://www.onsemi.com/pub_link/Collateral/MMSZ4678T1-D.PDF
J3 = CMP-1712-00002-6: NexarPartId: 20081794; Number of Contacts: 2; Pitch: 2.54mm; Connector Type: Male Pin; Voltage Rating: 250V; Current Rating: 3A; Gender: Male; Contact Resistance: 20mΩ; Height: 8.94mm; Lead Free: Lead Free; Number of Pins: 2; Termination: Through Hole; RoHS: Compliant; Lead Pitch: 2.54mm; REACH SVHC: No SVHC; Housing Material: PBT; Contact Mating Length: 5.9944mm; Min Operating Temperature: -40°C; Orientation: Vertical; Contact Material: Copper; Contact Gender: Male; Max Operating Temperature: 125°C; Number of Rows: 1; Number of Positions: 2; Packaging: Bulk; Contact Plating: Gold; Mount: Through Hole; Color: Black; Operating Supply Voltage: 250V
J4 = CMP-1502-03253-2: NexarPartId: 19991173; Insulation Resistance: 1GΩ; Contact Resistance: 30mΩ; Number of Contacts: 5; Number of Ports: 1; Gender: Receptacle; Current Rating: 1A; Connector Type: USB; Voltage Rating: 30V; USB Standard: USB 2.0; Plating: Nickel; Max Operating Temperature: 105°C; Orientation: Horizontal; Height: 2.9mm; Termination: Solder; Min Operating Temperature: -40°C; Number of Pins: 5; Flammability Rating: UL94 V-0; Lead Free: Lead Free; Packaging: Tape and Reel; Contact Plating: Gold; RoHS: Compliant; Mount: Horizontal, Surface Mount; Color: Black; REACH SVHC: Unknown; Operating Supply Voltage: 30V; Contact Material: Copper; Number of Positions: 5; Length: 5.9mm
L1 = CMP-03913-133884705-1: 74408063470 Power Ind, 47Uh, Shielded, 0.8A Rohs Compliant: Yes; Inductance: 47µH; Current Rating: 800mA; DC Resistance (DCR): 365mΩ; Ambient Temperature Range Low: -40°C; NexarPartId: 133884705; Height: 2.85mm; RoHS: Compliant; Ambient Temperature Range High: 85°C; Length: 5.9mm; Max Operating Temperature: 125°C; Width: 5.9mm; Saturation Current: 800mA; Min Operating Temperature: -40°C
Q1 = CMP-1058-00744-1: Trench Power MOSFET, -20 V, Single P-Channel, 3-Pin SOT-23, Pb-Free, Tape and Reel; Manufacturer: On Semiconductor; Crss Typ (pF): 75; V(BR)DSS Min (V): 20; Coss Typ (pF): 100; Ciss Typ (pF): 675; VGS Max (V): 8; Channel Polarity: P Channel; ID Max (A): 3.2; VGS(th) Max (V): 1.2; Qrr Typ (nC): 1008; ComponentLink2URL: http://www.onsemi.cn/pub_link/Collateral/NTR4101P-D.PDF; PartNumber: NTRV4101PT1G; ComponentLink1Description: Manufacturer URL; Packing: Tape and Reel; ComponentLink1URL: http://www.onsemi.com/; PackageReference: SOT-23-3-318-08; ComponentLink3URL: http://www.onsemi.cn/pub_link/Collateral/318-08.PDF; PackageVersion: Rev. AP, 11/2009; Package Type: SOT-23-3; Configuration: Single; ComponentLink3Description: Package Specification; Mounting Technology: Surface Mount; RoHS: Pb-Free; ComponentLink2Description: Datasheet; PackageDescription: 3-Pin Small Outline Transistor, Body 2.92 x 1.3 mm, Pitch 0.95 mm; DatasheetVersion: Rev. 9
R25 = WFC1206R1500FE66: Resistor 0.5W; Value: 0R15
R26 = CRCW06038K20FKEA: Resistor 0.1W; Value: 8K2
R27 = CRCW06032K70FKEA: Resistor 0.1W; Value: 2K7
R28 = CRCW060310K0FKEA: Resistor 0.1W; Value: 10K
S1 = OS202013MT8QN1: Switch; Manufacturer_Name: C & K COMPONENTS; Datasheet Link: https://www.ckswitches.com/media/1428/os.pdf; Height: 11mm; Manufacturer_Part_Number: OS202013MT8QN1; Mouser Part Number: 611-OS202013MT8QN1; Mouser Price/Stock: https://www.mouser.co.uk/ProductDetail/CK/OS202013MT8QN1?qs=WtljUlYws5RhlgqE4KzYAw%3D%3D; Arrow Part Number: OS202013MT8QN1; Arrow Price/Stock: https://www.arrow.com/en/products/os202013mt8qn1/ck?region=europe
U3 = NCV3063DR2G: Integrated Circuit; Manufacturer_Name: onsemi; Datasheet Link: https://www.onsemi.com/pub/Collateral/NCP3063-D.PDF; Height: 1.75mm; Manufacturer_Part_Number: NCV3063DR2G; Mouser Part Number: 863-NCV3063DR2G; Arrow Part Number: NCV3063DR2G; Arrow Price/Stock: https://www.arrow.com/en/products/ncv3063dr2g/on-semiconductor
U4 = CMP-0136-00458-1: 500 mA, Low Voltage, Low Quiescent Current LDO Regulator, 3-Pin SOT-223, Extended Temperature; PackageReference: SOT-223-DB3; PackageDescription: 3-Lead Plastic Small Outline Transistor (DB) [SOT-223]; PackageVersion: revBB, Aug-2009; DatasheetVersion: revB, Feb-2008

## Nets that join several sheets
3V3: Ethernet (12 pins), Periph (8 pins), Controller (29 pins), Power (C31.2 U4.3)
5V: Periph (5 pins), Power (7 pins)
GND: Ethernet (17 pins), Periph (17 pins), Controller (31 pins), Power (16 pins)
CRS_DV: Ethernet (R20.1), Controller (U1.32)
DSP_BL: Periph (J8.8), Controller (U1.9)
DSP_CLK: Periph (J8.4), Controller (U1.78)
DSP_CS: Periph (J8.5), Controller (U1.79)
DSP_DC: Periph (J8.6), Controller (U1.7)
DSP_DIN: Periph (J8.3), Controller (U1.80)
DSP_NRST: Periph (J8.7), Controller (U1.8)
I2C1_SCL: Periph (J9.2 R29.1 U5.2), Controller (U1.95)
I2C1_SDA: Periph (J9.1 R30.1 U5.4), Controller (U1.93)
LED_DATA: Periph (U6.2), Controller (U1.77)
MDC: Ethernet (U2.12), Controller (U1.16)
MDIO: Ethernet (U2.11), Controller (U1.25)
PD0: Periph (J6.9), Controller (U1.81)
PD1: Periph (J6.8), Controller (U1.82)
PD2: Periph (J6.7), Controller (U1.83)
PD3: Periph (J6.6), Controller (U1.84)
PD4: Periph (J6.5), Controller (U1.85)
PD5: Periph (J6.4), Controller (U1.86)
PD6: Periph (J6.3), Controller (U1.87)
PD7: Periph (J6.2), Controller (U1.88)
PE0: Periph (J7.2), Controller (U1.97)
PE1: Periph (J7.3), Controller (U1.98)
PE2: Periph (J7.4), Controller (U1.1)
PE3: Periph (J7.5), Controller (U1.2)
PE4: Periph (J7.6), Controller (U1.3)
PE5: Periph (J7.7), Controller (U1.4)
PE6: Periph (J7.8), Controller (U1.5)
PE7: Periph (J7.9), Controller (U1.38)
PE8: Periph (J7.10), Controller (U1.39)
PE9: Periph (J7.11), Controller (U1.40)
PE10: Periph (J7.12), Controller (U1.41)
PE11: Periph (J7.13), Controller (U1.42)
PE12: Periph (J7.14), Controller (U1.43)
PE13: Periph (J7.15), Controller (U1.44)
PE14: Periph (J7.16), Controller (U1.45)
PE15: Periph (J7.17), Controller (U1.46)
PHY_INT: Ethernet (U2.21), Controller (U1.54)
PHY_NRST: Ethernet (R16.1 U2.32), Controller (U1.53)
RMII_CLK: Ethernet (R19.1), Controller (U1.24)
RX_D0: Ethernet (R21.1), Controller (U1.33)
RX_D1: Ethernet (R22.1), Controller (U1.34)
SPI1_CLK: Periph (J11.1), Controller (U1.30)
SPI1_CS: Periph (J11.4), Controller (U1.29)
SPI1_MISO: Periph (J11.2), Controller (U1.31)
SPI1_MOSI: Periph (J11.3), Controller (U1.91)
TX_D0: Ethernet (U2.24), Controller (R2.2)
TX_D1: Ethernet (U2.25), Controller (R3.2)
TX_EN: Ethernet (U2.23), Controller (R1.2)
USART6_RX: Periph (R32.1), Controller (U1.64)
USART6_TX: Periph (R31.1), Controller (U1.63)
USB_D_N: Controller (U1.70), Power (J4.2)
USB_D_P: Controller (U1.71), Power (J4.3)
USB_VBUS: Controller (U1.68), Power (J4.1 S1.3)